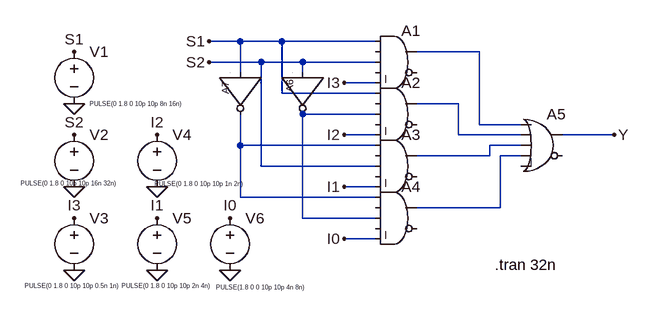
[diagram p0: schematic Multiplexer_4_to_1.asc]
Multiplexer_4_to_1.asc, the LTspice schematic file:
Version 4
SHEET 1 880 680
WIRE -64 64 -112 64
WIRE 0 64 -64 64
WIRE 144 64 0 64
WIRE 304 80 208 80
WIRE -32 96 -112 96
WIRE 32 96 -32 96
WIRE 144 96 32 96
WIRE -64 112 -64 64
WIRE 32 112 32 96
WIRE 144 128 96 128
WIRE 0 144 0 64
WIRE 144 144 0 144
WIRE 272 160 208 160
WIRE 144 176 32 176
WIRE 304 192 304 80
WIRE 368 192 304 192
WIRE 144 208 96 208
WIRE 272 208 272 160
WIRE 368 208 272 208
WIRE 512 208 432 208
WIRE -64 224 -64 176
WIRE 144 224 -64 224
WIRE 368 224 320 224
WIRE 320 240 320 224
WIRE 320 240 208 240
WIRE 368 240 336 240
WIRE -32 256 -32 96
WIRE 144 256 -32 256
WIRE 144 288 96 288
WIRE -64 304 -64 224
WIRE 144 304 -64 304
WIRE 336 320 336 240
WIRE 336 320 208 320
WIRE 32 336 32 176
WIRE 144 336 32 336
WIRE 144 368 96 368
FLAG 96 128 I3
FLAG 96 208 I2
FLAG 96 368 I0
FLAG -112 64 S1
FLAG -112 96 S2
FLAG 96 288 I1
FLAG 512 208 Y
FLAG -320 80 S1
FLAG -320 208 S2
FLAG -192 336 I1
FLAG -192 208 I2
FLAG -80 336 I0
FLAG -320 160 0
FLAG -320 336 I3
FLAG -320 288 0
FLAG -320 416 0
FLAG -192 288 0
FLAG -192 416 0
FLAG -80 416 0
SYMBOL Digital\\and 176 32 R0
SYMATTR InstName A1
SYMBOL Digital\\and 176 112 R0
SYMATTR InstName A2
SYMBOL Digital\\and 176 192 R0
SYMATTR InstName A3
SYMBOL Digital\\and 176 272 R0
SYMATTR InstName A4
SYMBOL Digital\\or 400 160 R0
SYMATTR InstName A5
SYMBOL Digital\\inv 96 112 R90
WINDOW 0 11 84 Left 1
SYMATTR InstName A6
SYMBOL Digital\\inv 0 112 R90
WINDOW 0 14 87 Left 1
SYMATTR InstName A7
SYMBOL voltage -320 64 R0
WINDOW 3 24 96 Left 0
WINDOW 123 0 0 Left 0
WINDOW 39 0 0 Left 0
SYMATTR Value PULSE(0 1.8 0 10p 10p 8n 16n)
SYMATTR InstName V1
SYMBOL voltage -320 192 R0
WINDOW 3 -82 90 Left 0
WINDOW 123 0 0 Left 0
WINDOW 39 0 0 Left 0
SYMATTR Value PULSE(0 1.8 0 10p 10p 16n 32n)
SYMATTR InstName V2
SYMBOL voltage -320 320 R0
WINDOW 3 -76 120 Left 0
WINDOW 123 0 0 Left 0
WINDOW 39 0 0 Left 0
SYMATTR Value PULSE(0 1.8 0 10p 10p 0.5n 1n)
SYMATTR InstName V3
SYMBOL voltage -192 192 R0
WINDOW 3 -4 91 Left 0
WINDOW 123 0 0 Left 0
WINDOW 39 0 0 Left 0
SYMATTR Value PULSE(0 1.8 0 10p 10p 1n 2n)
SYMATTR InstName V4
SYMBOL voltage -192 320 R0
WINDOW 3 -55 120 Left 0
WINDOW 123 0 0 Left 0
WINDOW 39 0 0 Left 0
SYMATTR Value PULSE(0 1.8 0 10p 10p 2n 4n)
SYMATTR InstName V5
SYMBOL voltage -80 320 R0
WINDOW 3 -21 122 Left 0
WINDOW 123 0 0 Left 0
WINDOW 39 0 0 Left 0
SYMATTR Value PULSE(1.8 0 0 10p 10p 4n 8n)
SYMATTR InstName V6
TEXT 328 408 Left 2 !.tran 32n

The netlist it stands for:
* Multiplexer_4_to_1.asc
A1 S1 0 S2 0 I3 0 N001 0 AND
A2 S1 0 N003 0 I2 0 N002 0 AND
A3 N004 0 S2 0 I1 0 N005 0 AND
A4 N004 0 N003 0 I0 0 N006 0 AND
A5 N001 N002 N005 N006 0 0 Y 0 OR
A6 S2 0 0 0 0 N003 0 0 BUF
A7 S1 0 0 0 0 N004 0 0 BUF
V1 S1 0 PULSE(0 1.8 0 10p 10p 8n 16n)
V2 S2 0 PULSE(0 1.8 0 10p 10p 16n 32n)
V3 I3 0 PULSE(0 1.8 0 10p 10p 0.5n 1n)
V4 I2 0 PULSE(0 1.8 0 10p 10p 1n 2n)
V5 I1 0 PULSE(0 1.8 0 10p 10p 2n 4n)
V6 I0 0 PULSE(1.8 0 0 10p 10p 4n 8n)
.tran 32n
.backanno
.end